# EAGLE design Light_sensor_multi_si11xx_veml6070 (EAGLE 9.4.0)
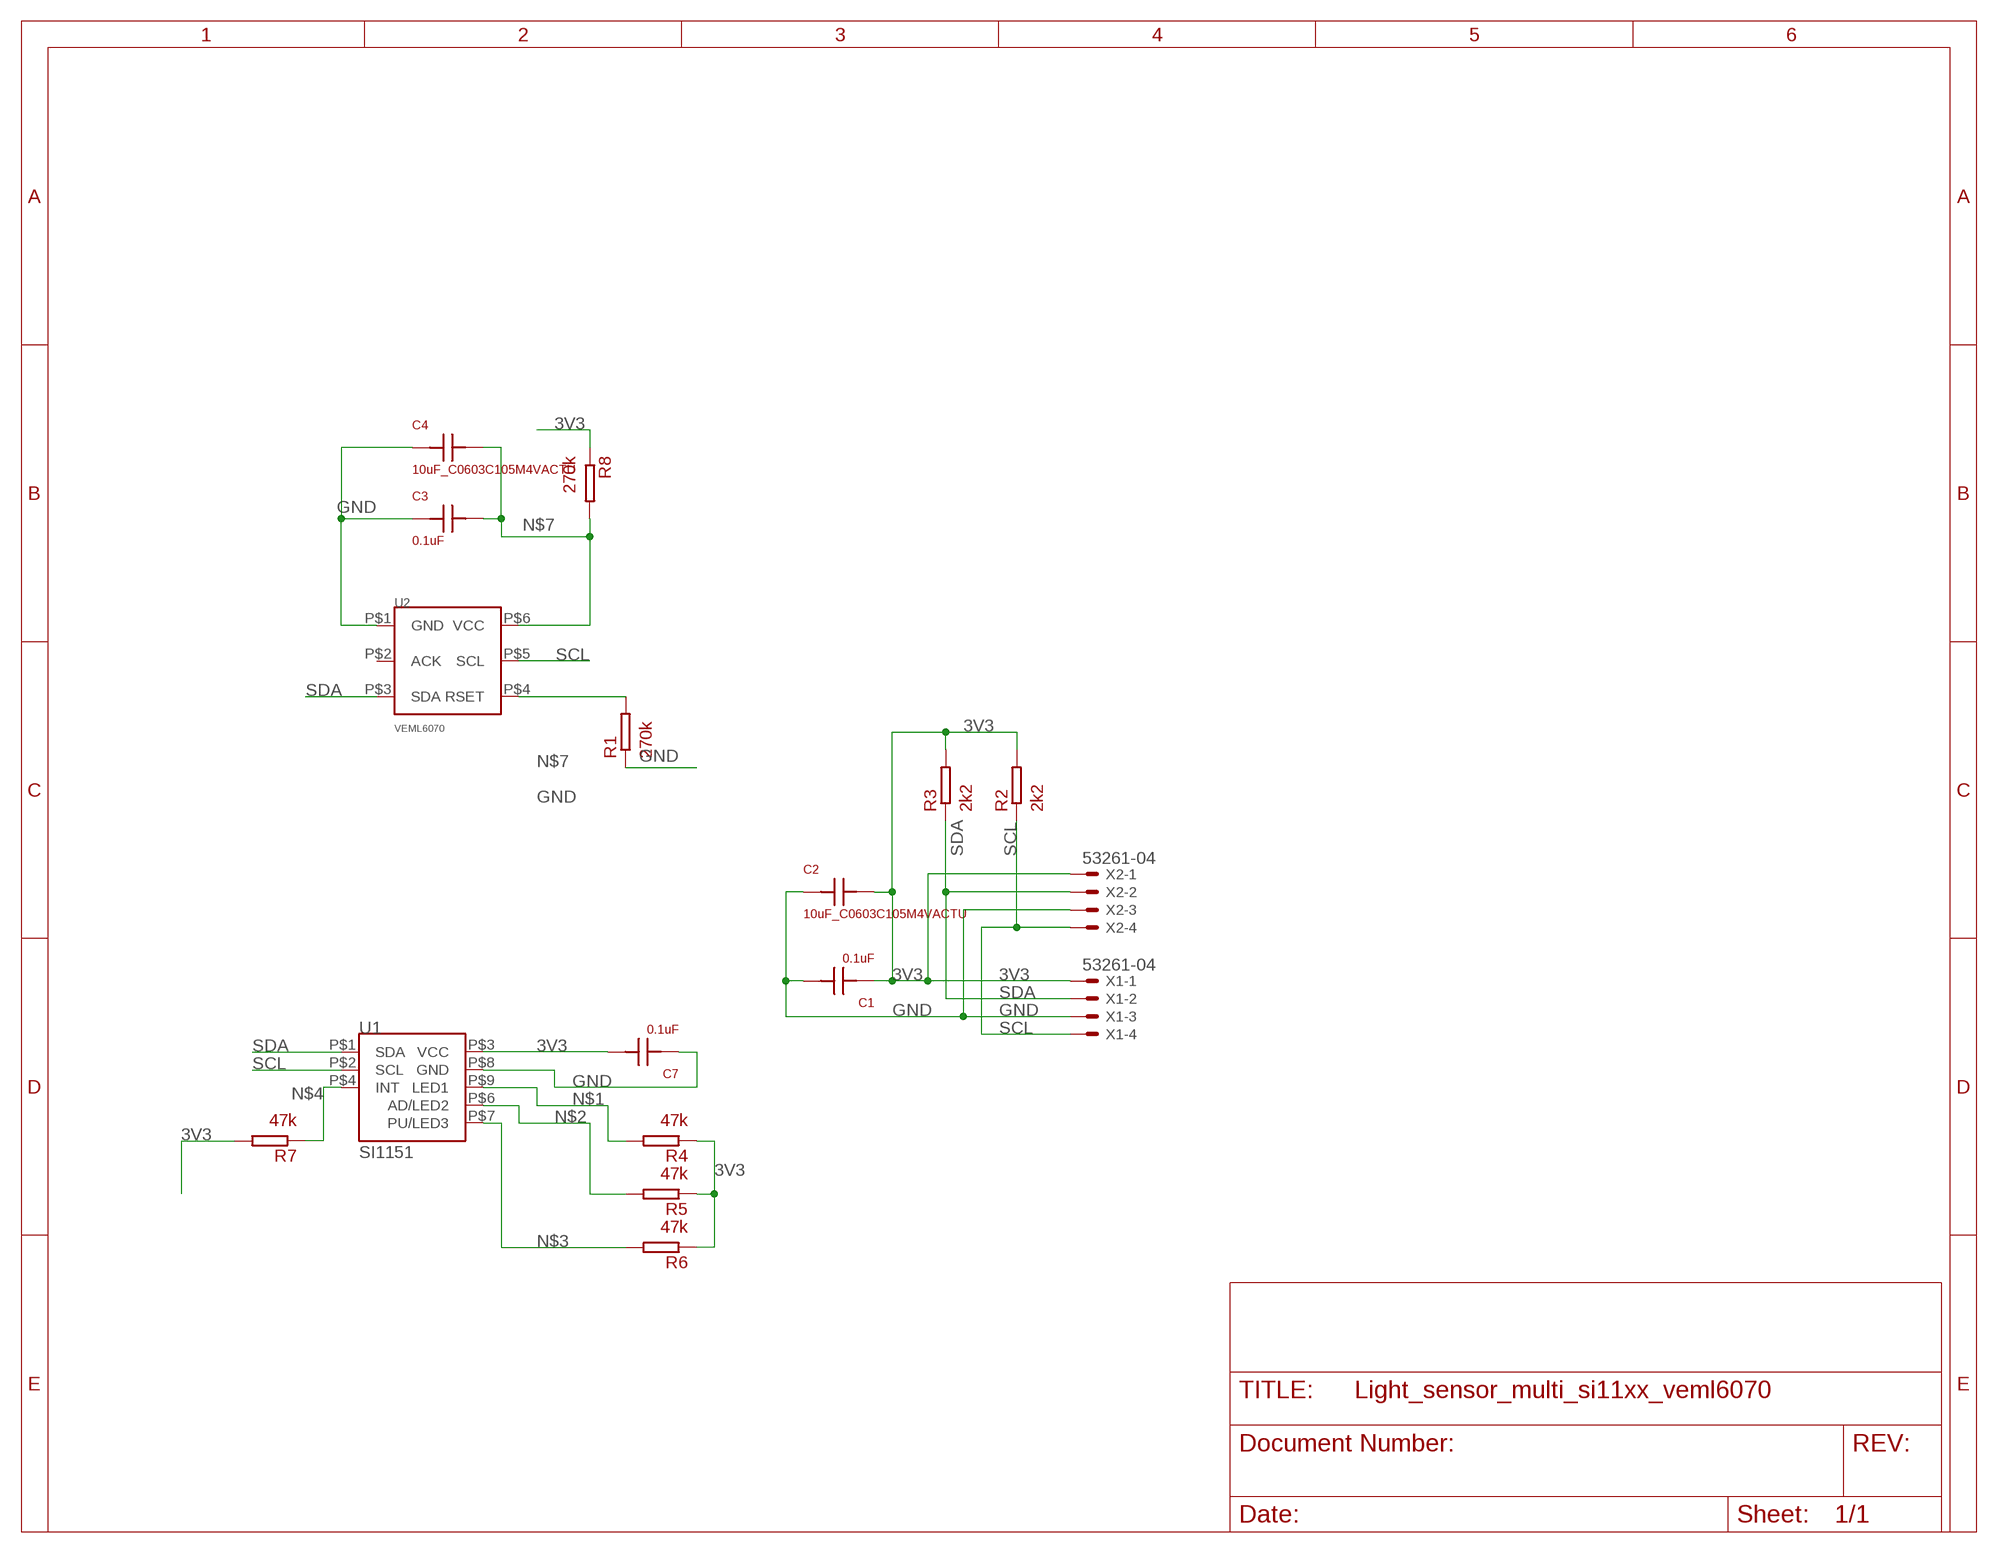
[diagram p0: schematic, sheet 1]

## Parts
C1  0.1uF  CAP_NP_0402  [SMD_0402]
C2  10uF_C0603C105M4VACTU  CAP_NP_1206  [SMD_1206]
C3  0.1uF  CAP_NP_0402  [SMD_0402]
C4  10uF_C0603C105M4VACTU  CAP_NP_1206  [SMD_1206]
C7  0.1uF  CAP_NP_0402  [SMD_0402]
R1  270k  RESISTOR_0402  [SMD_0402]
R2  2k2  RESISTOR_0402  [SMD_0402]
R3  2k2  RESISTOR_0402  [SMD_0402]
R4  47k  RESISTOR_0402  [SMD_0402]
R5  47k  RESISTOR_0402  [SMD_0402]
R6  47k  RESISTOR_0402  [SMD_0402]
R7  47k  RESISTOR_0402  [SMD_0402]
R8  270k  RESISTOR_0402  [SMD_0402]
U1  SI1151  SI1151_AB00_DFN10  [QFN10]
U2  VEML6070  VEML6070_OPLGA  [OPLGA-6]
X1  53261-04  [53261-04]
X2  53261-04  [53261-04]

## Nets
3V3: C1.P$1 C2.P$2 C7.P$2 R2.P$2 R3.P$2 R4.P$1 R5.P$1 R6.P$1 R7.P$2 R8.P$1 U1.P$3(VCC) X1.1 X2.1
GND: C1.P$2 C2.P$1 C3.P$1 C4.P$1 C7.P$1 R1.P$1 U1.P$8(GND) U2.P$1(GND) X1.3 X2.3
N$1: R4.P$2 U1.P$9(LED1)
N$2: R5.P$2 U1.P$6(AD/LED2)
N$3: R6.P$2 U1.P$7(PU/LED3)
N$4: R7.P$1 U1.P$4(INT)
N$5: R1.P$2 U2.P$4(RSET)
N$7: C3.P$2 C4.P$2 R8.P$2 U2.P$6(VCC)
SCL: R2.P$1 U1.P$2(SCL) U2.P$5(SCL) X1.4 X2.4
SDA: R3.P$1 U1.P$1(SDA) U2.P$3(SDA) X1.2 X2.2
Unconnected: U2.P$2(ACK)

## Library data of the parts
C1-C4 C7 = daneagle_db8.0:CAP_NP
R1-R8 = daneagle_db8.0:RESISTOR
U1 = daneagle_db8.0:SI1151_AB00
U2 = daneagle_db8.0:VEML6070
X1 X2 = con-molex:53?-04: CONNECTOR wire to board 1.25 mm (.049 inch) pitch header; MF: MOLEX; OC_FARNELL: 1125374; OC_NEWARK: unknown

## Board
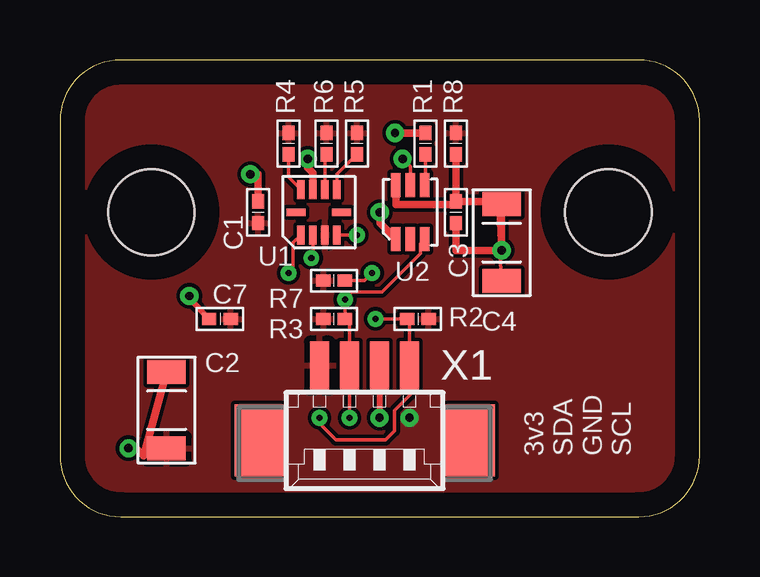
[diagram p1: board, top side]
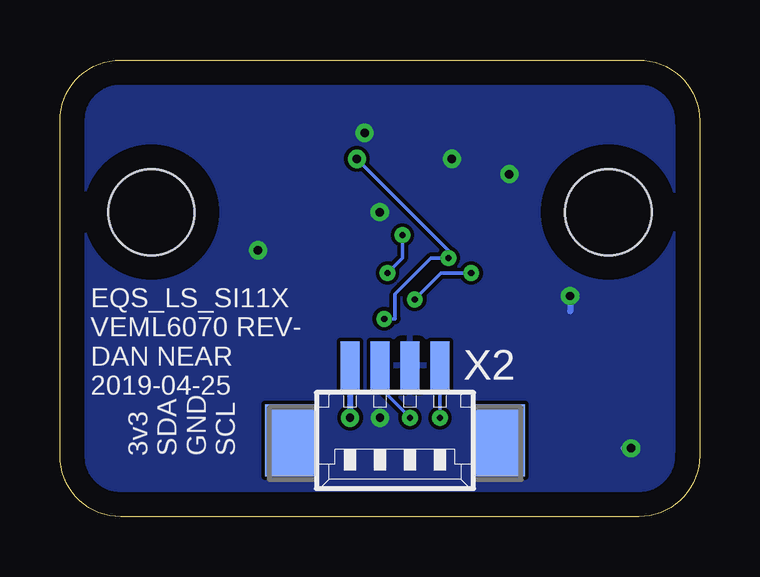
[diagram p2: board, bottom side, seen from below]

Size 26.67 x 19.05 mm. Coordinates in mm from the lower left corner, seen from the top.
Outline: 0,16.51 0,2.54 arc90 2.54,0 24.13,0 arc90 26.67,2.54 26.67,16.51 arc90 24.13,19.05 2.54,19.05 arc90 0,16.51
Copper layers (1*16): Top 0.035mm / dielectric 1.5mm / Bottom 0.035mm
Design rules "default": minimum track width 6mil, minimum drill 0.35mm, track to track 6mil, track to pad 6mil, pad to pad 6mil, via to via 6mil, smd to smd 6mil, copper to edge 40mil, drill to drill 6mil, minimum pad ring 10mil, minimum via ring 8mil, stop-mask expansion 4mil, vias tented up to drill 0mil, thermal gap 10mil
Holes 3.6 mm at 3.81,12.7 22.86,12.7
tKeepout: area 1,9.8 to 6.7,15.6; area 20,9.8 to 25.7,15.6

### Footprints (pad centres in the part's own frame; a part is rotated, then mirrored left to right if it is on the bottom)
SMD_0402 = smd 0.6 x 0.5: P$1 -0.45,0; P$2 0.45,0
SMD_1206 = smd 1 x 1.6: P$1 -1.6,0; P$2 1.6,0
QFN10 = smd 0.8 x 0.3: P$1 -0.95,0.75; P$2 -0.95,0.25; P$3 -0.95,-0.25; P$4 -0.95,-0.75; P$6 0.95,-0.75; P$7 0.95,-0.25; P$8 0.95,0.25; P$9 0.95,0.75 | smd 0.3 x 0.8: P$5 0,-0.95; P$10 0,0.95
OPLGA-6 = smd 1 x 0.4: P$1 -1.125,0.6; P$2 -1.125,0; P$3 -1.125,-0.6; P$4 1.125,-0.6; P$5 1.125,0; P$6 1.125,0.6
53261-04 = smd 0.8 x 2: 1 1.875,-2.5; 2 0.625,-2.5; 3 -0.625,-2.5; 4 -1.875,-2.5 | smd 2.1 x 3: S1 4.375,0.625; S2 -4.375,0.625

### Placement (x,y rotation side)
C1  8.26,12.7 90 top
C2  4.45,4.45 270 top
C3  16.51,12.7 90 top
C4  18.41,11.43 270 top
C7  6.67,8.26 0 top
R1  15.24,15.56 270 top
R2  14.92,8.26 0 top
R3  11.43,8.26 180 top
R4  9.53,15.56 270 top
R5  12.38,15.56 270 top
R6  11.11,15.56 270 top
R7  11.43,9.84 180 top
R8  16.51,15.56 270 top
U1  10.79,12.7 90 top
U2  14.61,12.7 90 top
X1  12.7,3.81 180 top
X2  12.7,3.81 180 bottom

### Tracks (layer width: path | path; a pad name or v marks a point on that pad's centre or on a via)
3V3  (via drill 0.35)
  Top 0.254: v14.57,4.13 14.61,4.13
  Bottom 0.254: X2.1 v14.57,4.13
  pour Top: 0,19.05 0,0 26.67,0 26.67,19.05
GND  (via drill 0.35)
  Top 0.254: C7.P$1 5.4,9.07 v5.4,9.21 | X1.3 v13.32,4.13
  Top 0.305: C2.P$1 3.49,2.54 3.17,2.86 v2.86,2.86 | C1.P$2 8.26,14.29 v7.94,14.29 | U1.P$8 10.54,14.34 10.33,14.55 v10.33,14.92 | U2.P$1 13.34,12.24 v13.34,12.7 | C3.P$1 16.51,11.11 v18.41,11.11 C4.P$1 | R1.P$1 v13.97,16.01
  Bottom 0.152: v10.33,14.92 10.48,14.92 | v13.97,16.01 13.97,16.19
  Bottom 0.254: v2.86,2.86 3.17,2.86 | v5.4,9.21 5.4,8.57 | v13.32,4.13 13.34,4.13
  pour Bottom: 0,19.05 0,0 26.67,0 26.67,19.05
N$1
  Top 0.152: U1.P$9 9.53,14.17 R4.P$2
N$2
  Top 0.152: U1.P$6 11.54,14.29 12.37,15.11 R5.P$2
N$3
  Top 0.152: R6.P$2 11.04,15.04 U1.P$7
N$4  (via drill 0.25)
  Top 0.152: U1.P$4 v12.38,11.75 | v13.02,10.16 12.7,9.84 R7.P$1
  Bottom 0.152: v12.38,11.75 12.38,10.79 v13.02,10.16
N$5
  Top 0.152: R1.P$2 15.24,13.86 U2.P$4
N$7
  Top 0.152: 16.38,13.02 C3.P$2 | C4.P$2 18.23,13.15
  Top 0.305: U2.P$6 14.01,13.02 16.38,13.02 | 18.23,13.15 C3.P$2 R8.P$2
SCL  (via drill 0.25, 0.35)
  Top 0.152: v10.82,4.13 10.82,3.88 11.51,3.2 13.58,3.2 13.95,3.58 13.95,4.43 14.6,5.08 14.59,6.3 X1.4 14.57,8.1 R2.P$1 v13.15,8.26 | v10.48,10.79 10.54,10.86 U1.P$2 | v14.29,14.92 14.61,14.61 U2.P$5
  Bottom 0.152: X2.4 v10.82,4.13 | v13.15,8.26 12.7,8.26 12.7,9.29 11.19,10.79 v10.48,10.79 10.48,11.11 v14.29,14.92
SDA  (via drill 0.25)
  Top 0.152: v12.07,4.13 X1.2 12.07,8.06 R3.P$1 v11.88,9.06 12.18,9.36 13.42,9.36 15.03,10.98 15.03,11.4 U2.P$3 | v9.53,10.16 9.73,10.16 9.73,11.43 U1.P$1
  Bottom 0.152: v12.07,4.13 v12.07,4.14 13.34,5.4 13.32,5.41 X2.2 | v11.88,9.06 10.78,10.16 v9.53,10.16

### Text on the board
tNames: 3v3 / SDA / GND / SCL
bNames: EQS_LS_SI11X / VEML6070 REV- / DAN NEAR / 2019-04-25 | 3v3 / SDA / GND / SCL